# EasyEDA Pro project ProPrj_NUEDC_TI-2025_Ctrller_Pltform_2025-08-02.epro, schematic Schematic1
Board Name: MSP-LITO-G3507; Create Date: 2025-07-21; Page Name: P1; Project Name: NUEDC TI-2025 Ctrller Pltform; Schematic Name: Schematic1; Update Date: 2025-07-24; Company: CQUPT; Drawed: WilliTourt; Page Size: A3; Reviewed: WilliTourt; Version: V1.0
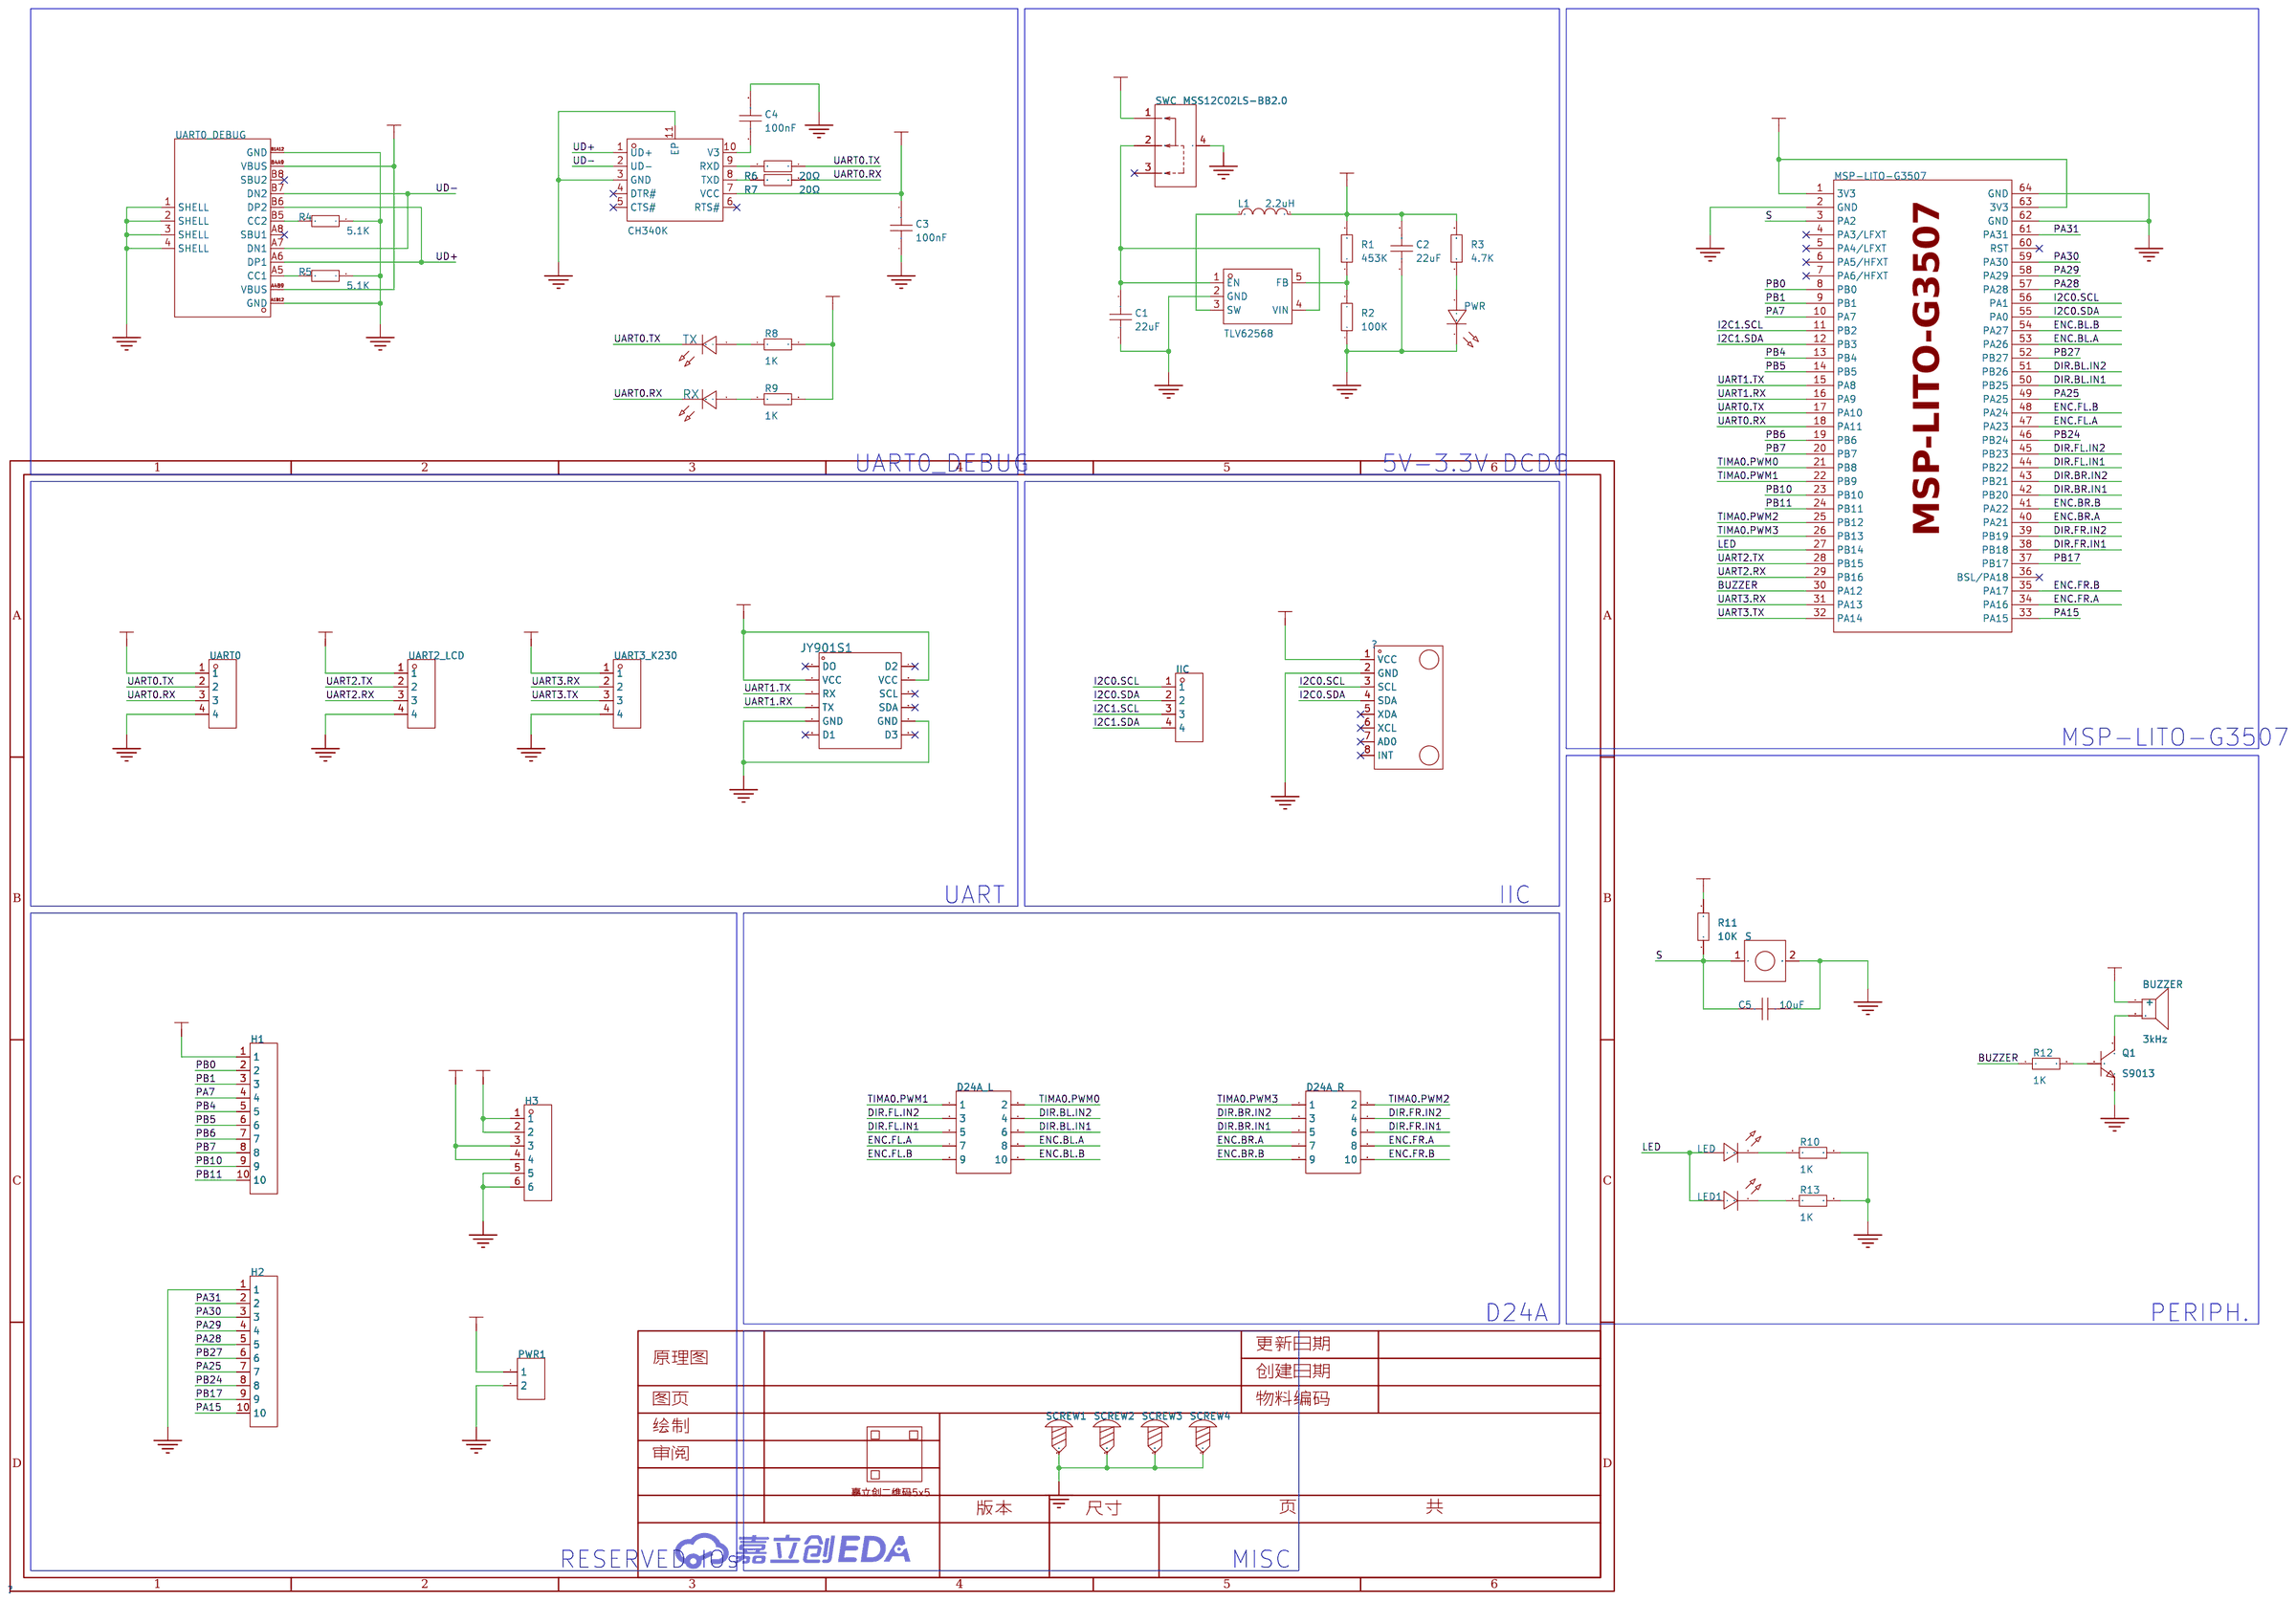
[diagram p0: schematic sheet]

## Parts
BUZZER  3kHz  [BUZ-SMD_L9.6-W9.6-LS10.0-R]
C1  22uF  [C0603]
C2  22uF  [C0603]
C3  100nF  [C0603]
C4  100nF  [C0603]
C5  10uF  [C0603]
CH340K  CH340K  [ESOP-10_L4.9-W3.9-P1.00-LS6.2-BL-EP]
D24A_L  -  [HDR-TH_10P-P2.54-V-F-R2-C5-S2.54]
D24A_R  -  [HDR-TH_10P-P2.54-V-F-R2-C5-S2.54]
H1  -  [HDR-TH_10P-P2.54-V-F]
H2  -  [HDR-TH_10P-P2.54-V-F]
H3  -  [HDR-TH_6P-P2.54-V-F]
IIC  -  [HDR-TH_4P-P2.54-V-F]
JY901S1  -  [JY901S]
L1  2.2uH  [IND-SMD_L3.0-W3.0_FNR30XXS]
LED  -  [LED0603]
LED1  -  [LED0603]
MPU6050  -  [MPU6050]
MSP-LITO-G3507  -  [MSP-LITO-G3507]
PWR  -  [LED0603]
PWR1  -  [HDR-TH_2P-P2.54-V-F]
Q1  S9013  [SOT-23-3_L2.9-W1.4-P1.90-LS2.6-BR]
QR  -  [JLC-QRCODE-5x5]
R1  453K  [R0603]
R2  100K  [R0603]
R3  4.7K  [R0603]
R4  5.1K  [R0603]
R5  5.1K  [R0603]
R6  20Ω  [R0603]
R7  20Ω  [R0603]
R8  1K  [R0603]
R9  1K  [R0603]
R10  1K  [R0603]
R11  10K  [R0603]
R12  1K  [R0603]
R13  1K  [R0603]
RX  -  [LED0603]
S  -  [6*6*5 硅胶开关]
SCREW1  -  [M3螺丝]
SCREW2  -  [M3螺丝]
SCREW3  -  [M3螺丝]
SCREW4  -  [M3螺丝]
SWC  MSS12C02LS-BB2.0  [SW-SMD_MSS12C02LS-HB2.0-1]
TLV62568  TLV62568DBVR  [SOT-23-5_L3.0-W1.7-P0.95-LS2.8-BR]
TX  -  [LED0603]
UART0  -  [HDR-TH_4P-P2.54-V-F]
UART0_DEBUG  Type-C-TOP_1  [USB-C-SMD_TYPE-C16PIN]
UART2_LCD  -  [HDR-TH_4P-P2.54-V-F]
UART3_K230  -  [HDR-TH_4P-P2.54-V-F]

## Library data of the parts
BUZZER = FUET-9650B-3V: 驱动方式:有源(内含驱动线路);构造类型:电磁式;频率:3kHz;声压(SPL):85dB;; LCSC Part Name: 电压 3V 频率 3KHZ; Supplier Part: C391032; Manufacturer: FUET(福声科技); Supplier Footprint: SMD,9.6x9.6mm; JLCPCB Part Class: 扩展库; Datasheet: https://atta.szlcsc.com/upload/public/pdf/source/20191031/C391032_DAAC75D3C9B9135EF0EA60697D179A21.pdf; Supplier: LCSC; Driver Circuitry: 有源(内含驱动线路); Technology: 电磁式; Voltage - Supply: 2V~5V; Sound Pressure Level(SPL): 85dB; Length: 9.6mm; Width: 9.6mm; Height: 5.5mm
C1-C5 = C0603: Supplier Footprint: 0603
CH340K = CH340K: 应用功能:USB转串口;接口协议:USB 2.0;通道数:-;数据速率:2Mbps;; LCSC Part Name: USB转串口芯片CH340; Supplier Part: C968586; Manufacturer: WCH(南京沁恒); Supplier Footprint: ESSOP-10-150mil-1mm; JLCPCB Part Class: 扩展库; Datasheet: https://atta.szlcsc.com/upload/public/pdf/source/20240313/C21A12AB66F63ABF8F8743FF13A35C95.pdf; Supplier: LCSC; Applications Function: USB转串口; Protocol: USB 2.0; Voltage - Supply: 3.3V；5V; Data Rate: 2Mbps; Operating Temperature: -20℃~+70℃
D24A_L D24A_R = HDR-F_2.54_2x5: Supplier Part: C92270; Supplier Footprint: 插件
H1 H2 = HDR-F_2.54_1x10P: Supplier Part: C2684744; Supplier Footprint: 插件
H3 = HDR-F_2.54_1x6P: Supplier Part: C40877; Supplier Footprint: 插件
IIC UART0 UART2_LCD UART3_K230 = HDR-F_2.54_1x4P: Supplier Part: C2718488; Supplier Footprint: 插件
JY901S1 = JY901S
L1 = FNR3015S2R2MT: 电感值:2.2uH;精度:±20%;额定电流:2A;饱和电流(Isat):2A;; LCSC Part Name: 2.2uH ±20% 2A; Supplier Part: C167747; Manufacturer: cjiang(长江微电); Supplier Footprint: SMD,3x3mm; JLCPCB Part Class: 扩展库; Datasheet: https://atta.szlcsc.com/upload/public/pdf/source/20190327/C167925_9EFF0AABC4CA629C2CC95961DBF7D39D.pdf; Supplier: LCSC; Tolerance: ±20%; Rated Current: 2A; Saturation Current (Isat): 2A; DC Resistance (DCR): 78mΩ
LED LED1 = LED0603-WHITE
MPU6050 = MPU6050
MSP-LITO-G3507 = MSP-LITO-G3507
PWR = LED0603-GREEN
PWR1 = HDR-F_2.54_1x2P: Supplier Part: C49661; Supplier Footprint: 插件
Q1 = S9013_C2836092: 晶体管类型:NPN;集电极电流(Ic):500mA;集射极击穿电压(Vceo):25V;功率(Pd):300mW;直流电流增益(hFE@Ic,Vce):120@50mA,1V;; LCSC Part Name: J3(J3表示丝印); Supplier Part: C2836092; Manufacturer: CBI(创基); Supplier Footprint: SOT-23; JLCPCB Part Class: 扩展库; Datasheet: https://atta.szlcsc.com/upload/public/pdf/source/20210621/C2836092_15188A6897D44309F7F2A6D715C57DA2.pdf; Supplier: LCSC; Transistor Type: NPN; Collector Current (Ic): 500mA; Collector-Emitter Breakdown Voltage (Vceo): 25V; Power Dissipation (Pd): 300mW; DC Current Gain (hFE@Ic,Vce): 120@50mA,1V; Transition Frequency (fT): 150MHz; Collector Cut-Off Current (Icbo): 100nA; Collector-Emitter Saturation Voltage (VCE(sat)@Ic,Ib): 600mV@500mA,50mA
QR = 嘉立创二维码5x5
R1-R13 = R0603: Supplier Footprint: 0603
RX TX = LED0603-ORANGE: Supplier Footprint: 0603
S = 6*6*5 硅胶开关
SCREW1-SCREW4 = M3螺丝: Supplier Footprint: 插件
SWC = MSS12C02LS-BB2.0: 电路结构:单刀双掷;安装方式:立贴;开关颜色:-;额定电流(DC):100mA;额定电压(DC):12V;额定电流(AC):-;额定电压(AC):-;机械寿命:1万次;; Supplier Part: C3008585; Manufacturer: SHOU HAN(首韩); Supplier Footprint: SMD; JLCPCB Part Class: 扩展库; Datasheet: https://atta.szlcsc.com/upload/public/pdf/source/20220429/8AEFBC67104491914BC5659DE1F359A3.pdf; Supplier: LCSC; Circuit: 单刀双掷; Pin Style: SMD接片; Switch Length: 6.65mm; Switch Width: 2.75mm; Switch Height: 1.4mm; Mounting Style: 立贴; Current Rating (DC): 100mA; Voltage Rating (DC): 12V; Mechanical Life: 1万次; Operating Temperature: -25℃~+70℃
TLV62568 = TLV62568DBVR: 功能类型:降压型;输出类型:可调;工作电压:2.5V~5.5V;输出电压:600mV~5.5V;输出电流:1A;; LCSC Part Name: 1A高效同步降压转换器; Supplier Part: C163219; Manufacturer: TI(德州仪器); Supplier Footprint: SOT-23-5; JLCPCB Part Class: 扩展库; Datasheet: https://www.ti.com/cn/lit/gpn/tlv62568; Supplier: LCSC; Function: 降压型; Output Type: 可调; Input Voltage: 2.5V~5.5V; Output Voltage: 600mV~5.5V; Output Current: 1A; Switching Frequency: 1.5MHz; Operating Temperature: -40℃~+125℃@(TJ); Synchronous Rectification: 是; Number of Outputs: 1; Topology: 降压式; Switch tube (built-in/external): 内置
UART0_DEBUG = Type-C-TOP_1: Supplier Part: C9900005857; Supplier Footprint: Type-C16P; JLCPCB Part Class: 扩展库; Supplier: LCSC; Check: false

## Nets
3V3: BUZZER.1(+) C2.2 C3.2 CH340K.7(VCC) H1.1 H3.3 H3.4 JY901S1.2(VCC) JY901S1.8(VCC) L1.2 MPU6050.1(VCC) MSP-LITO-G3507.1(3V3) MSP-LITO-G3507.63(3V3) R1.2 R3.2 R8.2 R9.2 R11.2 UART0.1 UART2_LCD.1 UART3_K230.1
5V: H3.1 H3.2 PWR1.1 SWC.1 UART0_DEBUG.A4B9(VBUS) UART0_DEBUG.B4A9(VBUS)
GND: C1.1 C2.1 C3.1 C4.2 C5.1 CH340K.3(GND) CH340K.11(EP) H2.1 H3.5 H3.6 JY901S1.5(GND) JY901S1.11(GND) MPU6050.2(GND) MSP-LITO-G3507.2(GND) MSP-LITO-G3507.62(GND) MSP-LITO-G3507.64(GND) PWR.1(C) PWR1.2 Q1.2(E) R2.1 R4.1 R5.1 R10.2 R13.2 S.2 SCREW1.1 SCREW2.1 SCREW3.1 SCREW4.1 SWC.4 TLV62568.2(GND) UART0.4 UART0_DEBUG.1(SHELL) UART0_DEBUG.2(SHELL) UART0_DEBUG.3(SHELL) UART0_DEBUG.4(SHELL) UART0_DEBUG.A1B12(GND) UART0_DEBUG.B1A12(GND) UART2_LCD.4 UART3_K230.4
BUZZER: MSP-LITO-G3507.30(PA12) R12.1
DIR.BL.IN1: D24A_L.6 MSP-LITO-G3507.50(PB25)
DIR.BL.IN2: D24A_L.4 MSP-LITO-G3507.51(PB26)
DIR.BR.IN1: D24A_R.5 MSP-LITO-G3507.42(PB20)
DIR.BR.IN2: D24A_R.3 MSP-LITO-G3507.43(PB21)
DIR.FL.IN1: D24A_L.5 MSP-LITO-G3507.44(PB22)
DIR.FL.IN2: D24A_L.3 MSP-LITO-G3507.45(PB23)
DIR.FR.IN1: D24A_R.6 MSP-LITO-G3507.38(PB18)
DIR.FR.IN2: D24A_R.4 MSP-LITO-G3507.39(PB19)
ENC.BL.A: D24A_L.8 MSP-LITO-G3507.53(PA26)
ENC.BL.B: D24A_L.10 MSP-LITO-G3507.54(PA27)
ENC.BR.A: D24A_R.7 MSP-LITO-G3507.40(PA21)
ENC.BR.B: D24A_R.9 MSP-LITO-G3507.41(PA22)
ENC.FL.A: D24A_L.7 MSP-LITO-G3507.47(PA23)
ENC.FL.B: D24A_L.9 MSP-LITO-G3507.48(PA24)
ENC.FR.A: D24A_R.8 MSP-LITO-G3507.34(PA16)
ENC.FR.B: D24A_R.10 MSP-LITO-G3507.35(PA17)
I2C0.SCL: IIC.1 MPU6050.3(SCL) MSP-LITO-G3507.56(PA1)
I2C0.SDA: IIC.2 MPU6050.4(SDA) MSP-LITO-G3507.55(PA0)
I2C1.SCL: IIC.3 MSP-LITO-G3507.11(PB2)
I2C1.SDA: IIC.4 MSP-LITO-G3507.12(PB3)
LED: LED.2(A) LED1.2(A) MSP-LITO-G3507.27(PB14)
PA7: H1.4 MSP-LITO-G3507.10(PA7)
PA15: H2.10 MSP-LITO-G3507.33(PA15)
PA25: H2.7 MSP-LITO-G3507.49(PA25)
PA28: H2.5 MSP-LITO-G3507.57(PA28)
PA29: H2.4 MSP-LITO-G3507.58(PA29)
PA30: H2.3 MSP-LITO-G3507.59(PA30)
PA31: H2.2 MSP-LITO-G3507.61(PA31)
PB0: H1.2 MSP-LITO-G3507.8(PB0)
PB1: H1.3 MSP-LITO-G3507.9(PB1)
PB4: H1.5 MSP-LITO-G3507.13(PB4)
PB5: H1.6 MSP-LITO-G3507.14(PB5)
PB6: H1.7 MSP-LITO-G3507.19(PB6)
PB7: H1.8 MSP-LITO-G3507.20(PB7)
PB10: H1.9 MSP-LITO-G3507.23(PB10)
PB11: H1.10 MSP-LITO-G3507.24(PB11)
PB17: H2.9 MSP-LITO-G3507.37(PB17)
PB24: H2.8 MSP-LITO-G3507.46(PB24)
PB27: H2.6 MSP-LITO-G3507.52(PB27)
S: C5.2 MSP-LITO-G3507.3(PA2) R11.1 S.1
TIMA0.PWM0: D24A_L.2 MSP-LITO-G3507.21(PB8)
TIMA0.PWM1: D24A_L.1 MSP-LITO-G3507.22(PB9)
TIMA0.PWM2: D24A_R.2 MSP-LITO-G3507.25(PB12)
TIMA0.PWM3: D24A_R.1 MSP-LITO-G3507.26(PB13)
UART0.RX: MSP-LITO-G3507.18(PA11) R7.1 RX.1(C) UART0.3
UART0.TX: MSP-LITO-G3507.17(PA10) R6.1 TX.1(C) UART0.2
UART1.RX: JY901S1.4(TX) MSP-LITO-G3507.16(PA9)
UART1.TX: JY901S1.3(RX) MSP-LITO-G3507.15(PA8)
UART2.RX: MSP-LITO-G3507.29(PB16) UART2_LCD.3
UART2.TX: MSP-LITO-G3507.28(PB15) UART2_LCD.2
UART3.RX: MSP-LITO-G3507.31(PA13) UART3_K230.2
UART3.TX: MSP-LITO-G3507.32(PA14) UART3_K230.3
UD+: CH340K.1(UD+) UART0_DEBUG.A6(DP1) UART0_DEBUG.B6(DP2)
UD-: CH340K.2(UD-) UART0_DEBUG.A7(DN1) UART0_DEBUG.B7(DN2)
$1N5901: CH340K.9(RXD) R6.2
$1N5929: CH340K.8(TXD) R7.2
$1N6046: C4.1 CH340K.10(V3)
$1N7360: Q1.1(B) R12.2
$1N7363: BUZZER.2 Q1.3(C)
$1N7370: LED.1(C) R10.1
$1N18211: LED1.1(C) R13.1
Net-(C1-2): C1.2 SWC.2 TLV62568.1(EN) TLV62568.4(VIN)
Net-(L1-1): L1.1 TLV62568.3(SW)
Net-(PWR-2): PWR.2(A) R3.1
Net-(R1-1): R1.1 R2.2 TLV62568.5(FB)
Net-(R4-2): R4.2 UART0_DEBUG.B5(CC2)
Net-(R5-2): R5.2 UART0_DEBUG.A5(CC1)
Net-(R8-1): R8.1 TX.2(A)
Net-(R9-1): R9.1 RX.2(A)

Not connected (* = marked no-connect by the designer): CH340K 4(DTR#)* 5(CTS#)* 6(RTS#)*; JY901S1 1(DO)* 6(D1)* 7(D2)* 9(SCL)* 10(SDA)* 12(D3)*; MPU6050 5(XDA)* 6(XCL)* 7(AD0)* 8(INT)*; MSP-LITO-G3507 4(PA3/LFXT)* 5(PA4/LFXT)* 6(PA5/HFXT)* 7(PA6/HFXT)* 36(BSL/PA18)* 60(RST)*; SWC 3*; UART0_DEBUG A8(SBU1)* B8(SBU2)*

## Notes on the sheet
- UART0_DEBUG
- 5V-3.3V DCDC
- MSP-LITO-G3507
- UART
- IIC
- D24A
- PERIPH.
- RESERVED IOs
- MISC
